# EAGLE schematic BT832A (EAGLE 9.6.2)

## Sheet 1 of 3
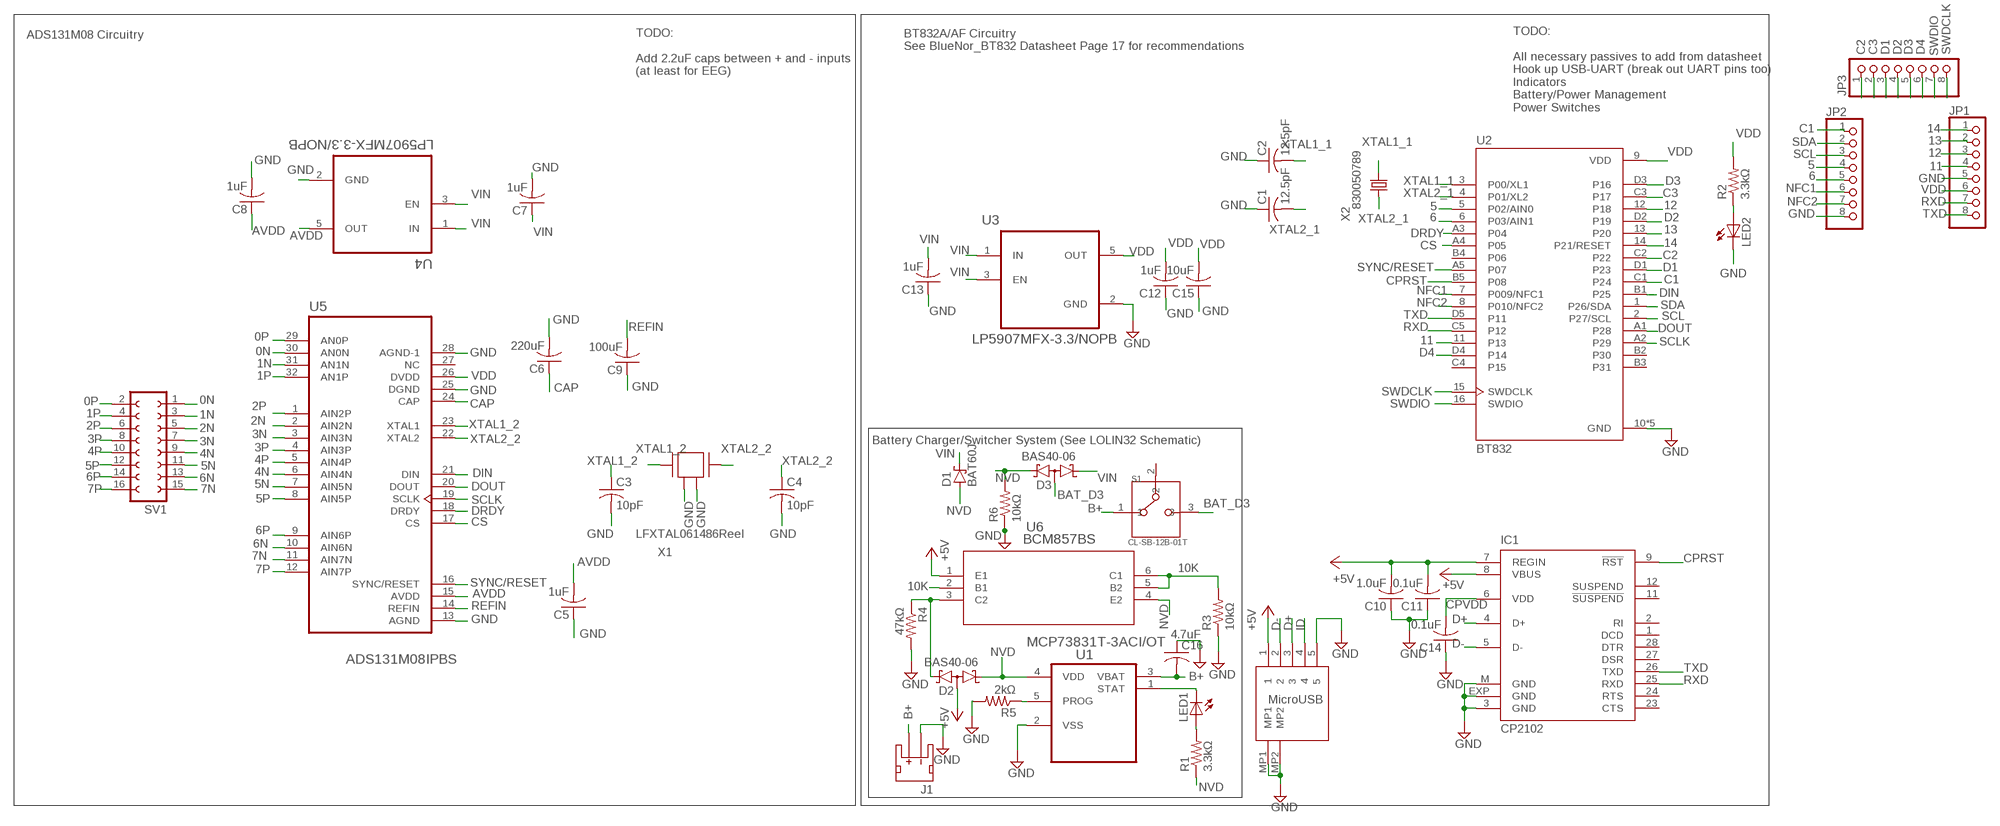
[diagram p0: schematic, sheet 1]

### Parts
C1  12.5pF  C-USC0402  [C0402]
C2  12.5pF  C-USC0402  [C0402]
C3  10pF  C-USC0402  [C0402]
C4  10pF  C-USC0402  [C0402]
C5  1uF  C-USC0402  [C0402]
C6  220uF  C-USC0402  [C0402]
C7  1uF  C-USC0402  [C0402]
C8  1uF  C-USC0402  [C0402]
C9  100uF  C-USC0402  [C0402]
C10  1.0uF  C-USC0402  [C0402]
C11  0.1uF  C-USC0402  [C0402]
C12  1uF  C-USC0402  [C0402]
C13  1uF  C-USC0402  [C0402]
C14  0.1uF  C-USC0402  [C0402]
C15  10uF  C-USC0402  [C0402]
C16  4.7uF  C-USC0402  [C0402]
D1  BAT60J  [SOD323_ST]
D2  BAS40-06  [SOT23]
D3  BAS40-06  [SOT23]
IC1  CP2102  [MLP28]
J1  JST_2MM_MALE  [JST-2-SMD]
JP1  PINHD-1X8CLEANBIG  [1X08-CLEANBIG]
JP2  PINHD-1X8CLEANBIG  [1X08-CLEANBIG]
JP3  PINHD-1X8CLEANBIG  [1X08-CLEANBIG]
LED1  LEDCHIP-LED0603  [CHIP-LED0603]
LED2  LEDCHIP-LED0603  [CHIP-LED0603]
R1  3.3kΩ  R-US_R0402  [R0402]
R2  3.3kΩ  R-US_R0402  [R0402]
R3  10kΩ  R-US_R0402  [R0402]
R4  47kΩ  R-US_R0402  [R0402]
R5  2kΩ  R-US_R0402  [R0402]
R6  10kΩ  R-US_R0402  [R0402]
S1  CL-SB-12B-01T  [CL-SB-12B]
SV1  FE08-2  [FE08-2]
U1  MCP73831T-3ACI/OT  [SOT95P270X145-5N]
U2  BT832  [BLEMODULE_BT832]
U3  LP5907MFX-3.3/NOPB  [SOT95P280X145-5N]
U4  LP5907MFX-3.3/NOPB  [SOT95P280X145-5N]
U5  ADS131M08IPBS  [QFP50P700X700X120-32N]
U6  BCM857BS  [SOT363_NEX]
U$1  DX4R005JJ2R1800  [DX4R005JJ2R1800]
X1  ABM3B-8.000MHZ-B2-T  [ABM3B-8.000MHZ-B2-T]
X2  FC-12M  [FC-12M]

### Nets
0N: SV1.1 U5.30(AN0N)
0P: SV1.2 U5.29(AN0P)
1N: SV1.3 U5.31(AN1N)
1P: SV1.4 U5.32(AN1P)
2N: SV1.5 U5.2(AIN2N)
2P: SV1.6 U5.1(AIN2P)
3N: SV1.7 U5.3(AIN3N)
3P: SV1.8 U5.4(AIN3P)
4N: SV1.9 U5.6(AIN4N)
4P: SV1.10 U5.5(AIN4P)
5: JP2.4 U2.5(P02/AIN0)
5N: SV1.11 U5.7(AIN5N)
5P: SV1.12 U5.8(AIN5P)
6: JP2.5 U2.6(P03/AIN1)
6N: SV1.13 U5.10(AIN6N)
6P: SV1.14 U5.9(AIN6P)
7N: SV1.15 U5.11(AIN7N)
7P: SV1.16 U5.12(AIN7P)
10K: R3.2 U6.2(B1) U6.5(B2) U6.6(C1)
11: JP1.4 U2.11(P13)
12: JP1.3 U2.12(P18)
13: JP1.2 U2.13(P20)
14: JP1.1 U2.14(P21/RESET)
+5V: C10.2 C11.2 D2.3(AA) IC1.7(REGIN) IC1.8(VBUS) U6.1(E1) U$1.1
AVDD: C5.2 C8.1 U4.5(OUT) U5.15(AVDD)
B+: C16.2 J1.2(+) S1.1 U1.3(VBAT)
BAT_D3: D3.3(AA) S1.3
C1: JP2.1 U2.C1(P24)
C2: JP3.1 U2.C2(P22)
C3: JP3.2 U2.C3(P17)
CAP: C6.1 U5.24(CAP)
CPRST: IC1.9(!RST) U2.B5(P08)
CPVDD: C14.2 IC1.6(VDD)
CS: U2.A4(P05) U5.17(CS)
D1: JP3.3 U2.D1(P23)
D2: JP3.4 U2.D2(P19)
D3: JP3.5 U2.D3(P16)
D4: JP3.6 U2.D4(P14)
D+: IC1.4(D+) U$1.3
D-: IC1.5(D-) U$1.2
DIN: U2.B1(P25) U5.21(DIN)
DOUT: U2.A1(P28) U5.20(DOUT)
DRDY: U2.A3(P04) U5.18(DRDY)
GND: C1.1 C2.1 C3.2 C4.2 C5.1 C6.2 C7.2 C8.2 C9.1 C10.1 C11.1 C12.1 C13.1 C14.1 C15.1 C16.1 IC1.3(GND) IC1.EXP(GND) IC1.M(GND) J1.1(-) JP1.5 JP2.8 LED2.C R3.1 R4.2 R5.2 R6.1 U1.2(VSS) U2.10(GND) U2.A0(GND) U2.B0(GND) U2.C0(GND) U2.D0(GND) U3.2(GND) U4.2(GND) U5.13(AGND) U5.25(DGND) U5.28(AGND-1) U$1.5 U$1.MP1 U$1.MP2 X1.2 X1.4
ID: U$1.4
N$1: LED2.A R2.1
N$9: R5.1 U1.5(PROG)
N$11: LED1.A R1.2
N$14: D2.2(K2) R4.1 U6.3(C2)
N$18: LED1.C U1.1(STAT)
NFC1: JP2.6 U2.7(P009/NFC1)
NFC2: JP2.7 U2.8(P010/NFC2)
NVD: D1.A D2.1(K1) D3.2(K2) R1.1 R6.2 U1.4(VDD) U6.4(E2)
REFIN: C9.2 U5.14(REFIN)
RXD: IC1.25(RXD) JP1.7 U2.C5(P12)
SCL: JP2.3 U2.2(P27/SCL)
SCLK: U2.A2(P29) U5.19(SCLK)
SDA: JP2.2 U2.1(P26/SDA)
SWDCLK: JP3.8 U2.15(SWDCLK)
SWDIO: JP3.7 U2.16(SWDIO)
SYNC/RESET: U2.A5(P07) U5.16(SYNC/RESET)
TXD: IC1.26(TXD) JP1.8 U2.D5(P11)
VDD: C12.2 C15.2 JP1.6 R2.2 U2.9(VDD) U3.5(OUT) U5.26(DVDD)
VIN: C7.1 C13.2 D1.C D3.1(K1) U3.1(IN) U3.3(EN) U4.1(IN) U4.3(EN)
XTAL1_1: C2.2 U2.3(P00/XL1) X2.2
XTAL1_2: C3.1 U5.23(XTAL1) X1.1
XTAL2_1: C1.2 U2.4(P01/XL2) X2.1
XTAL2_2: C4.1 U5.22(XTAL2) X1.3
Unconnected: IC1.1(DCD) IC1.2(RI) IC1.11(!SUSPEND) IC1.12(SUSPEND) IC1.23(CTS) IC1.24(RTS) IC1.27(DSR) IC1.28(DTR) J1.NC1(PAD1) J1.NC2(PAD2) S1.2 U2.B2(P30) U2.B3(P31) U2.B4(P06) U2.C4(P15) U5.27(NC)

### Notes on the sheet
- ADS131M08 Circuitry
- BT832A/AF Circuitry
  See BlueNor_BT832 Datasheet Page 17 for recommendations
- TODO:
  
  Add 2.2uF caps between + and - inputs
  (at least for EEG)
- TODO:
  
  All necessary passives to add from datasheet
  Hook up USB-UART (break out UART pins too)
  Indicators
  Battery/Power Management
  Power Switches
- 830050789
- Battery Charger/Switcher System (See LOLIN32 Schematic)
- LFXTAL061486Reel
- MicroUSB

## Sheet 2 of 3

## Sheet 3 of 3

## Library data of the parts
C1-C16 = adafruit:C-US: CAPACITOR, American symbol
D1 = diode:BAT60J: Schottky barrier diode Source: www.st.com, BAT60J.pdf
D2 D3 = diode:BAS40-06: Silicon Schottky Diodes General-purpose diode for high-speed switching
IC1 = silabs:CP210*: Single-Chip USB to UART Bridge Source: www.silabs.com .. CP2101.pdf / cp2102.pdf; MF: FARNELL; MPN: CP2102-GM; OC_FARNELL: 9282130; OC_NEWARK: 30K5635
J1 = SparkFun-Connectors:JST_2MM_MALE: JST 2MM MALE RA CONNECTOR Two pin, compact surface mount connector. Commonly used as a battery input connection point. We really like the solid locking feeling and high current rating on these small connectors. We use these all the time as battery connectors. Mates to single-cell LiPo batteries. Here is the connector we sell at SparkFun: JST Right Angle Connector - White <https://www.sparkfun.com/products/8612> (PRT-08612) Datasheet <http://www.sparkfun.com/datasheets/Prototyping/Connectors/JST-Horizontal.pdf> It was used on these SparkFun products: SparkFun MOSFET Power Controller <https://www.sparkfun.com/products/11214> (PRT-11214) SparkFun Battery Babysitter - LiPo Battery Manager <https://www.sparkfun.com/products/13777> (PRT-13777) And many, many others that required a lipo battery connection.; PROD_ID: CONN-11443; SF_ID: PRT-08612
JP1-JP3 = adafruit:PINHD-1X8: PIN HEADER
LED1 LED2 = adafruit:LED: LED OSRAM: - CHIPLED LG R971, LG N971, LY N971, LG Q971, LY Q971, LO R971, LY R971 LH N974, LH R974 LS Q976, LO Q976, LY Q976 LO Q996 - Hyper CHIPLED LW Q18S LB Q993, LB Q99A, LB R99A - SideLED LS A670, LO A670, LY A670, LG A670, LP A670 LB A673, LV A673, LT A673, LW A673 LH A674 LY A675 LS A676, LA A676, LO A676, LY A676, LW A676 LS A679, LY A679, LG A679 - Hyper Micro SIDELED® LS Y876, LA Y876, LO Y876, LY Y876 LT Y87S - SmartLED LW L88C, LW L88S LB L89C, LB L89S, LG L890 LS L89K, LO L89K, LY L89K LS L896, LA L896, LO L896, LY L896 - TOPLED LS T670, LO T670, LY T670, LG T670, LP T670 LSG T670, LSP T670, LSY T670, LOP T670, LYG T670 LG T671, LOG T671, LSG T671 LB T673, LV T673, LT T673, LW T673 LH T674 LS T676, LA T676, LO T676, LY T676, LB T676, LH T676, LSB T676, LW T676 LB T67C, LV T67C, LT T67C, LS T67K, LO T67K, LY T67K, LW E67C LS E67B, LA E67B, LO E67B, LY E67B, LB E67C, LV E67C, LT E67C LW T67C LS T679, LY T679, LG T679 LS T770, LO T770, LY T770, LG T770, LP T770 LB T773, LV T773, LT T773, LW T773 LH T774 LS E675, LA E675, LY E675, LS T675 LS T776, LA T776, LO T776, LY T776, LB T776 LHGB T686 LT T68C, LB T68C - Hyper Mini TOPLED® LB M676 - Mini TOPLED Santana® LG M470 LS M47K, LO M47K, LY M47K Source: http://www.osram.convergy.de/
R1-R6 = adafruit:R-US_: RESISTOR, American symbol
S1 = CL-SB-12B-01T:CL-SB-12B-01T: Check prices <https://pricing.snapeda.com/parts/CL-SB-12B-01T/Nidec%20Copal/view-part?ref=eda>; AVAILABILITY: In Stock; DESCRIPTION: Slide Switch SPDT Surface Mount; MF: Nidec Copal; MP: CL-SB-12B-01T; PACKAGE: None; PRICE: None
SV1 = con-lsta:FE08-2: FEMALE HEADER; OC_FARNELL: unknown; OC_NEWARK: unknown
U1 = MCP73831T-3ACI_OT:MCP73831T-3ACI/OT: Li-Polymer Charge Management Controllers, SOT23-5 Check prices <https://pricing.snapeda.com/parts/MCP73831T-3ACI/OT/Microchip/view-part?ref=eda>; AVAILABILITY: In Stock; DESCRIPTION: Charger IC Lithium Ion/Polymer SOT-23-5; MF: Microchip; MP: MCP73831T-3ACI/OT; PACKAGE: SOT-23-5 Microchip; PRICE: None
U2 = BT832:BT832: BLE 5 Module: Nordic nRF52832 SoC, Cortex M4F with PCB trace antenna Check prices <https://pricing.snapeda.com/parts/BT832/Fanstel%20Corp./view-part?ref=eda>; AVAILABILITY: Not in stock; DESCRIPTION: Bluetooth Bluetooth v5.0 Transceiver Module 2.4GHz Integrated, Trace Surface Mount; MF: Fanstel Corp.; MP: BT832; PACKAGE: Module Fanstel Corp.; PRICE: None
U3 U4 = LP5907MFX-3.3_NOPB:LP5907MFX-3.3/NOPB: IC REG LINEAR 3.3V 250MA SOT23; AVAILABILITY: Unavailable; DESCRIPTION: Linear Voltage Regulator IC 1 Output 250mA SOT-23-5; MF: Texas Instruments; MP: LP5907MFX-3.3/NOPB; PACKAGE: SOT-23 Texas Instruments; PRICE: None
U5 = ADS131M08IPBS:ADS131M08IPBS: None Check prices <https://pricing.snapeda.com/parts/ADS131M08IPBS/Texas%20Instruments/view-part?ref=eda>; AVAILABILITY: Warning; DESCRIPTION: 24-bit 32-kSPS 8-channelsimultaneous-sampling delta-sigma ADC 32-TQFP -40 to 125; MF: Texas Instruments; MP: ADS131M08IPBS; PACKAGE: TQFP-32 Texas Instruments; PRICE: None; PURCHASE-URL: https://pricing.snapeda.com/search/part/ADS131M08IPBS/?ref=eda
U6 = BCM857BS:BCM857BS; COPYRIGHT: Copyright (C) 2016 Accelerated Designs. All rights reserved; MANUFACTURER_PART_NUMBER: BCM857BS; SOURCELIBRARY: Nexperia_2018-05-2018; VENDOR: Nexperia
U$1 = DX4R005JJ2R1800:DX4R005JJ2R1800: Check prices <https://pricing.snapeda.com/parts/DX4R005JJ2R1800/JAE%20Electronics/view-part?ref=eda>; AVAILABILITY: In Stock; DESCRIPTION: USB - micro B USB 2.0 Receptacle Connector 5 Position Surface Mount, Right Angle; Through Hole; MF: JAE Electronics; MP: DX4R005JJ2R1800; PACKAGE: None; PRICE: None
X1 = Crystals_Oscillators:ABM3B-8.000MHZ-B2-T: CRYSTAL 8.0000MHZ 18PF SMD Manufacturer's datasheet <https://abracon.com/Resonators/abm3b.pdf>; CREATED_BY: PCBLayout.com; DIGIKEY_PART_NUMBER: 535-9720-2-ND; MANUFACTURER: Abracon LLC; MPN: ABM3B-8.000MHZ-B2-T; PACKAGE: SMD 4
X2 = crystal:FC-12M: kHz RANGE CRYSTAL UNIT LOW PROFILE SMD Source: Epson Toyocom FC-12M.pdf